# Altium project project_11.PrjPcb
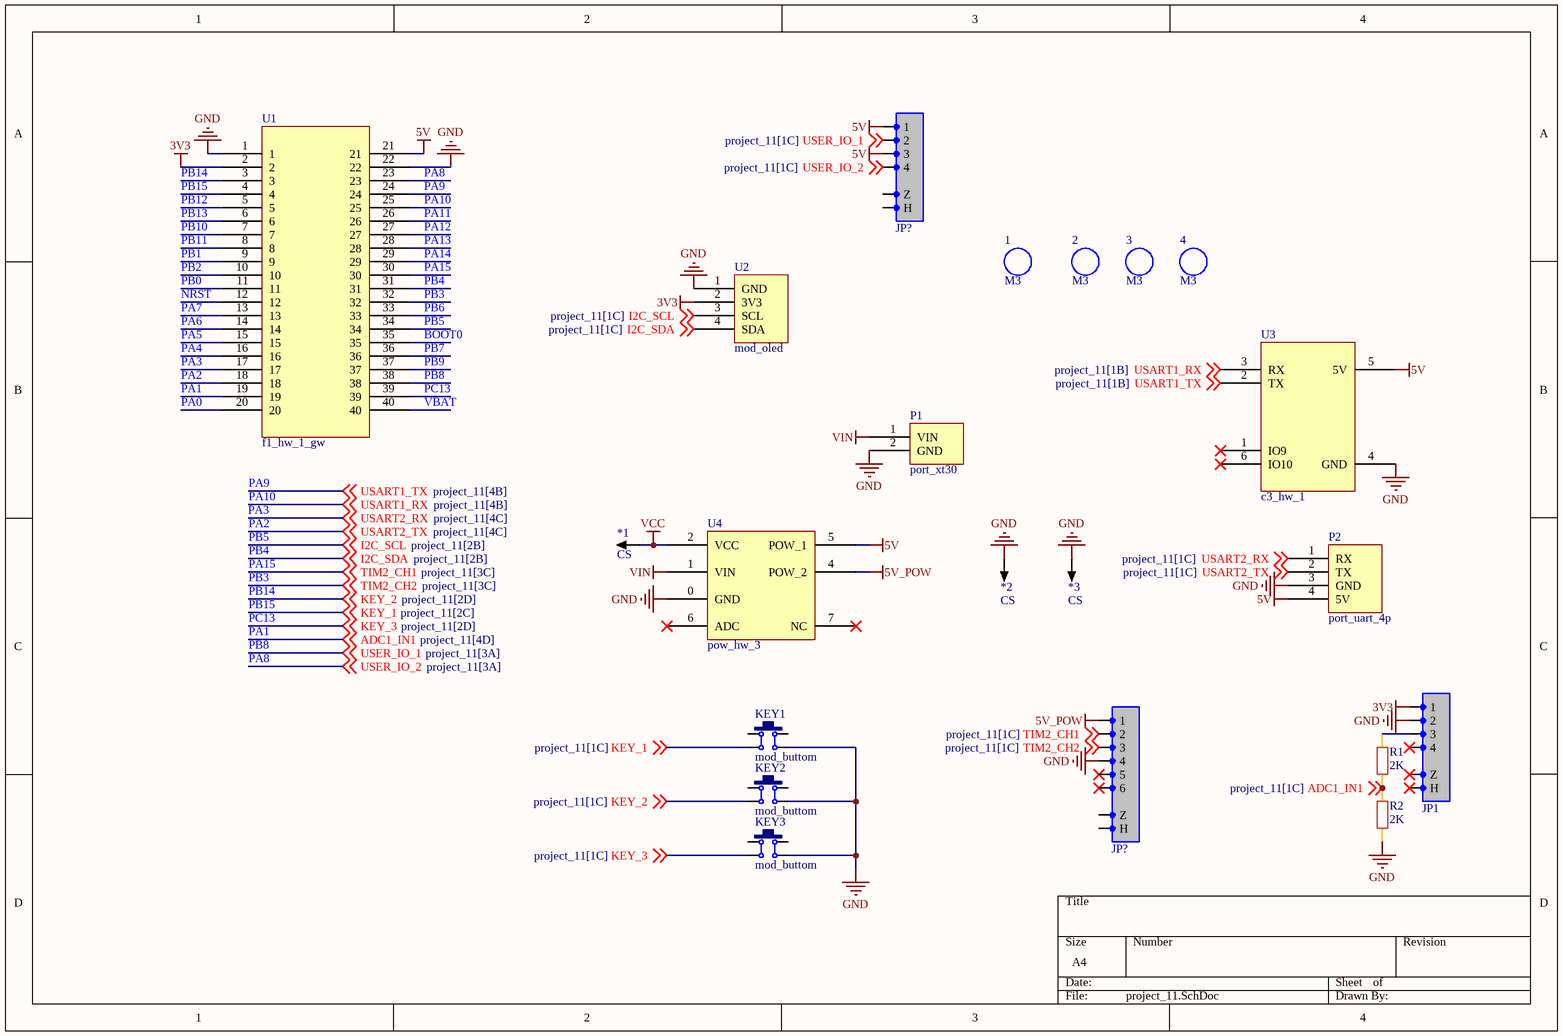
[diagram p0: project_11.SchDoc]
1 sheet, 21 parts. Net scope: global (net labels, ports and power ports of the same name join across sheets).
Board file: project_11.PcbDoc

## Sheet project_11.SchDoc
size A4; SheetNumber: 1; SheetTotal: 1

### Parts
(Parts that share a designator on the sheet are numbered #1, #2 ... from top to bottom, then left to right.)
1  M3  [M3 125X200]
2  M3  [M3 125X200]
3  M3  [M3 125X200]
4  M3  [M3 125X200]
*1  CS  [R100]
*2  CS  [R100]
*3  CS  [R100]
JP1  HDR-1X4  [HDR2.54-M-LI-4P]  (value not drawn)
JP?#1  HDR-1X4  [HDR2.54-M-LI-4P]  (value not drawn)
JP?#2  HDR-1X6  [XH2.54-LI-6P]  (value not drawn)
KEY1  mod_buttom  [MOD_BUTTOM]
KEY2  mod_buttom  [MOD_BUTTOM]
KEY3  mod_buttom  [MOD_BUTTOM]
P1  port_xt30  [MOD_XT30]
P2  port_uart_4p  [XH2.54_4P]
R1  2K  [R 0603_L]
R2  2K  [R 0603_L]
U1  f1_hw_1_gw  [F1_HW_1_GW]
U2  mod_oled  [MOD_OLED]
U3  c3_hw_1  [C3_HW_1]
U4  pow_hw_3  [POW_HW_3]

### Nets
3V3: JP1.1 U1.2 U2.2(3V3)
5V: JP?#1.1 JP?#1.3 P2.4(5V) U1.21 U3.5(5V) U4.5(POW_1)
5V_POW: JP?#2.1 U4.4(POW_2)
GND: *2.1 *3.1 JP1.2 JP?#2.4 KEY1.3 KEY2.3 KEY3.3 P1.2(GND) P2.3(GND) R2.2 U1.1 U1.22 U2.1(GND) U3.4(GND) U4.0(GND)
VCC: *1.1 U4.2(VCC)
VIN: P1.1(VIN) U4.1(VIN)
BOOT0: U1.35
NRST: U1.12
PA0: U1.20
PA1: R1.2 R2.1 U1.19 ; off-sheet ADC1_IN1  [also labelled ADC1_IN1]
PA2: P2.2(TX) U1.18 ; off-sheet USART2_TX  [also labelled USART2_TX]
PA3: U1.17
PA4: U1.16
PA5: U1.15
PA6: U1.14
PA7: U1.13
PA8: JP?#1.4 U1.23 ; off-sheet USER_IO_2  [also labelled USER_IO_2]
PA9: U1.24 U3.2(TX) ; off-sheet USART1_TX  [also labelled USART1_TX]
PA10: U1.25 U3.3(RX) ; off-sheet USART1_RX  [also labelled USART1_RX]
PA11: U1.26
PA12: U1.27
PA13: U1.28
PA14: U1.29
PA15: JP?#2.2 U1.30 ; off-sheet TIM2_CH1  [also labelled TIM2_CH1]
PB0: U1.11
PB1: U1.9
PB2: U1.10
PB3: JP?#2.3 U1.32 ; off-sheet TIM2_CH2  [also labelled TIM2_CH2]
PB4: U1.31 U2.4(SDA) ; off-sheet I2C_SDA  [also labelled I2C_SDA]
PB5: U1.34 U2.3(SCL) ; off-sheet I2C_SCL  [also labelled I2C_SCL]
PB6: U1.33
PB7: U1.36
PB8: JP?#1.2 U1.38 ; off-sheet USER_IO_1  [also labelled USER_IO_1]
PB9: U1.37
PB10: U1.7
PB11: U1.8
PB12: U1.5
PB13: U1.6
PB14: KEY2.4 U1.3 ; off-sheet KEY_2  [also labelled KEY_2]
PB15: KEY1.4 U1.4 ; off-sheet KEY_1  [also labelled KEY_1]
PC13: KEY3.4 U1.39 ; off-sheet KEY_3  [also labelled KEY_3]
USART2_RX: P2.1(RX) ; off-sheet USART2_RX
VBAT: U1.40
NetJP1_3: JP1.3 R1.1

Not connected (* = marked no-connect by the designer): JP1 0(Z)* 4* 100(H)*; JP?#1 0(Z) 100(H); JP?#2 0(Z) 5* 6* 100(H); KEY1 1 2; KEY2 1 2; KEY3 1 2; U3 1(IO9)* 6(IO10)*; U4 6(ADC)* 7(NC)*

### Notes on the sheet
- Labels drawn without touching a wire or pin: PA3

### Library data of the parts
1-4 = prot_m3: m3铜柱孔; BOM名称: 铜柱孔; 版权归属: 源创客; 学习资源: www.ooocke.com
*1-*3 = CS: 探针焊盘; 版权归属: 源创客; BOM名称: 探针焊盘; 学习资源: www.ooocke.com
JP1 JP?#1 = Header 4: 4P接插件; 版权归属: 源创客; BOM名称: 4P接插件; 学习资源: www.ooocke.com
JP?#2 = Header 6: 6P接插件; 版权归属: 源创客; BOM名称: 6P接插件; 学习资源: www.ooocke.com
KEY1-KEY3 = mod_buttom: 6*6*4.3按键
P1 = port_xt30: XT30接口
P2 = port_uart_4p: 串口接口/SPP蓝牙模块 / XH2.54弯排针4p/4p排母
R1 R2 = 电阻: 贴片电阻1%精度
U2 = mod_oled: oled模块 / 4p排母
U3 = c3_hw_1: ESP32C3蓝牙模块 / 6p排母
U4 = pow_hw_3: 两路降压电源模块